# EAGLE design OpenExtruderPCB (EAGLE 9.5.2)
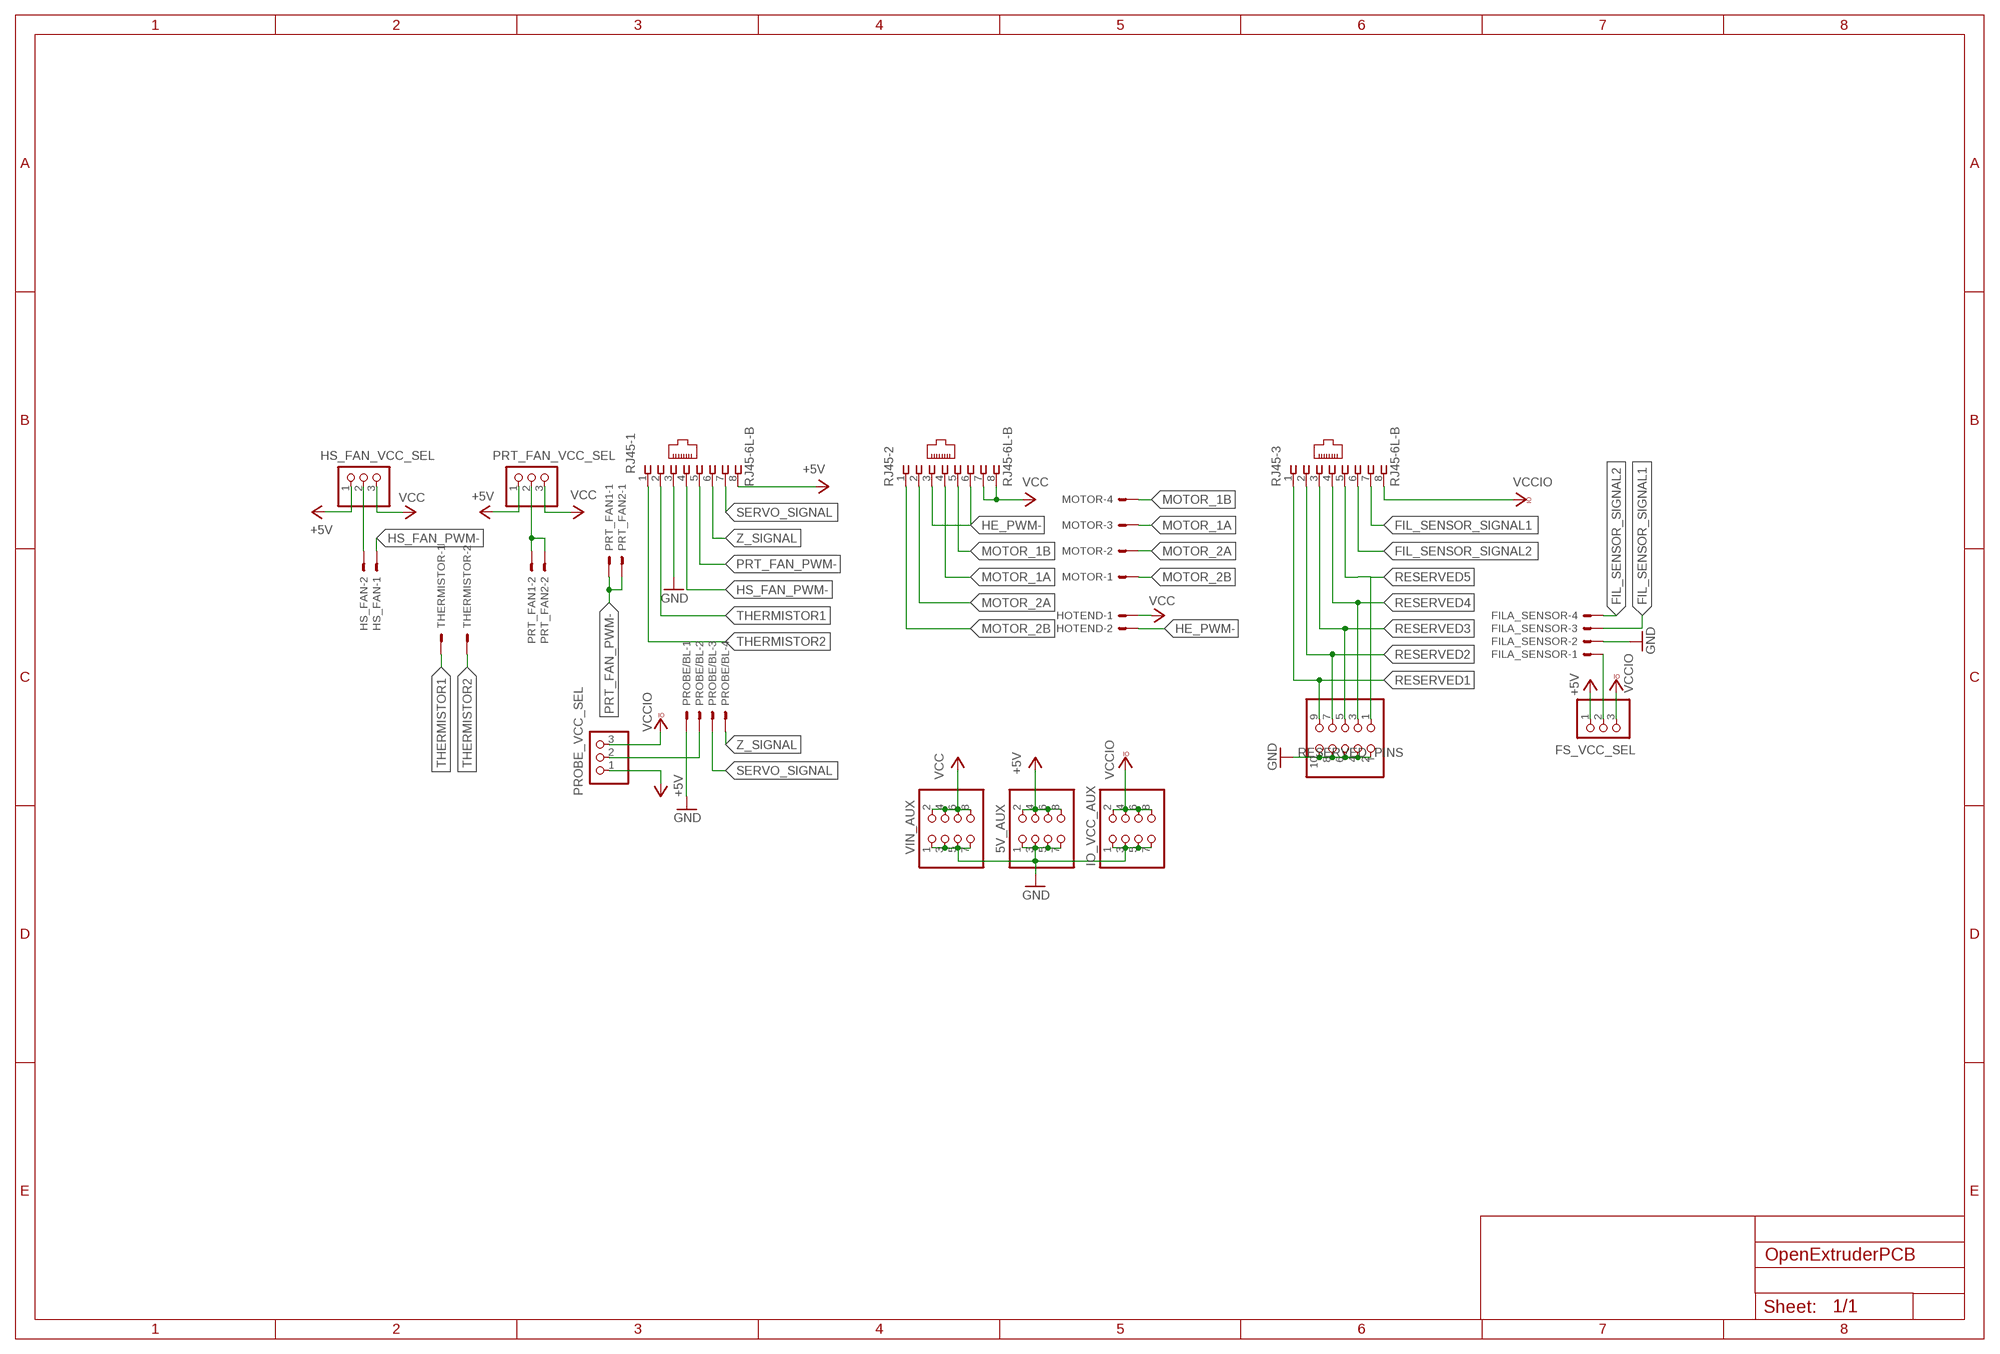
[diagram p0: schematic, sheet 1]

## Parts
5V_AUX  PINHD-2X4M  [2X04M]
FILA_SENSOR  JST-XH-04-PIN-ROUND-PAD  [JST-XH-04-PACKAGE-ROUND-PAD]
FS_VCC_SEL  PINHD-1X3  [1X03]
HOTEND  JST-XH-02-PIN-LONG-PAD  [JST-XH-02-PACKAGE-LONG-PAD]
HS_FAN  JST-XH-02-PIN-ROUND-PAD  [JST-XH-02-PACKAGE-ROUND-PAD]
HS_FAN_VCC_SEL  PINHD-1X3  [1X03]
IO_VCC_AUX  PINHD-2X4M  [2X04M]
MOTOR  JST-XH-04-PIN-LONG-PAD  [JST-XH-04-PACKAGE-LONG-PAD]
PROBE/BL  JST-XH-04-PIN-ROUND-PAD  [JST-XH-04-PACKAGE-ROUND-PAD]
PROBE_VCC_SEL  PINHD-1X3  [1X03]
PRT_FAN1  JST-XH-02-PIN-ROUND-PAD  [JST-XH-02-PACKAGE-ROUND-PAD]
PRT_FAN2  JST-XH-02-PIN-ROUND-PAD  [JST-XH-02-PACKAGE-ROUND-PAD]
PRT_FAN_VCC_SEL  PINHD-1X3  [1X03]
RESERVED_PINS  PINHD-2X5M  [2X05M]
RJ45-1  RJ45-6L-B  [RJ45-NO-SHIELD]
RJ45-2  RJ45-6L-B  [RJ45-NO-SHIELD]
RJ45-3  RJ45-6L-B  [RJ45-NO-SHIELD]
THERMISTOR  JST-XH-02-PIN-ROUND-PAD  [JST-XH-02-PACKAGE-ROUND-PAD]
VIN_AUX  PINHD-2X4M  [2X04M]

## Nets
+5V: 5V_AUX.2 5V_AUX.4 5V_AUX.6 5V_AUX.8 FS_VCC_SEL.1 HS_FAN_VCC_SEL.1 PROBE_VCC_SEL.1 PRT_FAN_VCC_SEL.1 RJ45-1.8
FIL_SENSOR_SIGNAL1: FILA_SENSOR.3 RJ45-3.7
FIL_SENSOR_SIGNAL2: FILA_SENSOR.4 RJ45-3.6
FS_VCC: FILA_SENSOR.1 FS_VCC_SEL.2
GND: 5V_AUX.1 5V_AUX.3 5V_AUX.5 5V_AUX.7 FILA_SENSOR.2 IO_VCC_AUX.1 IO_VCC_AUX.3 IO_VCC_AUX.5 IO_VCC_AUX.7 PROBE/BL.1 RESERVED_PINS.2 RESERVED_PINS.4 RESERVED_PINS.6 RESERVED_PINS.8 RESERVED_PINS.10 RJ45-1.3 VIN_AUX.1 VIN_AUX.3 VIN_AUX.5 VIN_AUX.7
HE_PWM-: HOTEND.2 RJ45-2.3 RJ45-2.6
HS_FAN_PWM-: HS_FAN.1 RJ45-1.4
HS_FAN_VCC: HS_FAN.2 HS_FAN_VCC_SEL.2
MOTOR_1A: MOTOR.3 RJ45-2.4
MOTOR_1B: MOTOR.4 RJ45-2.5
MOTOR_2A: MOTOR.2 RJ45-2.2
MOTOR_2B: MOTOR.1 RJ45-2.1
PROBE_VCC: PROBE/BL.2 PROBE_VCC_SEL.2
PRT_FAN_PWM-: PRT_FAN1.1 PRT_FAN2.1 RJ45-1.5
PRT_FAN_VCC: PRT_FAN1.2 PRT_FAN2.2 PRT_FAN_VCC_SEL.2
RESERVED1: RESERVED_PINS.9 RJ45-3.1
RESERVED2: RESERVED_PINS.7 RJ45-3.2
RESERVED3: RESERVED_PINS.5 RJ45-3.3
RESERVED4: RESERVED_PINS.3 RJ45-3.4
RESERVED5: RESERVED_PINS.1 RJ45-3.5
SERVO_SIGNAL: PROBE/BL.3 RJ45-1.7
THERMISTOR1: RJ45-1.2 THERMISTOR.1
THERMISTOR2: RJ45-1.1 THERMISTOR.2
VCC: HOTEND.1 HS_FAN_VCC_SEL.3 PRT_FAN_VCC_SEL.3 RJ45-2.7 RJ45-2.8 VIN_AUX.2 VIN_AUX.4 VIN_AUX.6 VIN_AUX.8
VCCIO: FS_VCC_SEL.3 IO_VCC_AUX.2 IO_VCC_AUX.4 IO_VCC_AUX.6 IO_VCC_AUX.8 PROBE_VCC_SEL.3 RJ45-3.8
Z_SIGNAL: PROBE/BL.4 RJ45-1.6

## Library data of the parts
5V_AUX IO_VCC_AUX VIN_AUX = pinhead:PINHD-2X4: PIN HEADER
FILA_SENSOR MOTOR PROBE/BL = Rembrandt Electronics - JST XH Connectors v1-0:JST-XH-04-PIN: JST XH Connector 2 Pin Wire to board connector. Pitch: 2,54 mm, (0.100") Number of pins: 4 Created by Rembrandt Electronics www.rembrandtelectronics.com
FS_VCC_SEL HS_FAN_VCC_SEL PROBE_VCC_SEL PRT_FAN_VCC_SEL = pinhead:PINHD-1X3: PIN HEADER
HOTEND HS_FAN PRT_FAN1 PRT_FAN2 THERMISTOR = Rembrandt Electronics - JST XH Connectors v1-0:JST-XH-02-PIN: JST XH Connector 2 Pin Wire to board connector. Pitch: 2,54 mm, (0.100") Number of pins: 2 Created by Rembrandt Electronics www.rembrandtelectronics.com
RESERVED_PINS = pinhead:PINHD-2X5: PIN HEADER
RJ45-1-RJ45-3 = con-tycoelectronics:RJ45: CORCOM Modular RJ Jacks No Shield Source: www.tycoelectronics.com .. ENG_DS_1654001_1099_RJ_L_0507.pdf; MPN: RJ45-6L-B; OC_FARNELL: unknown; OC_NEWARK: 16R6090

## Board
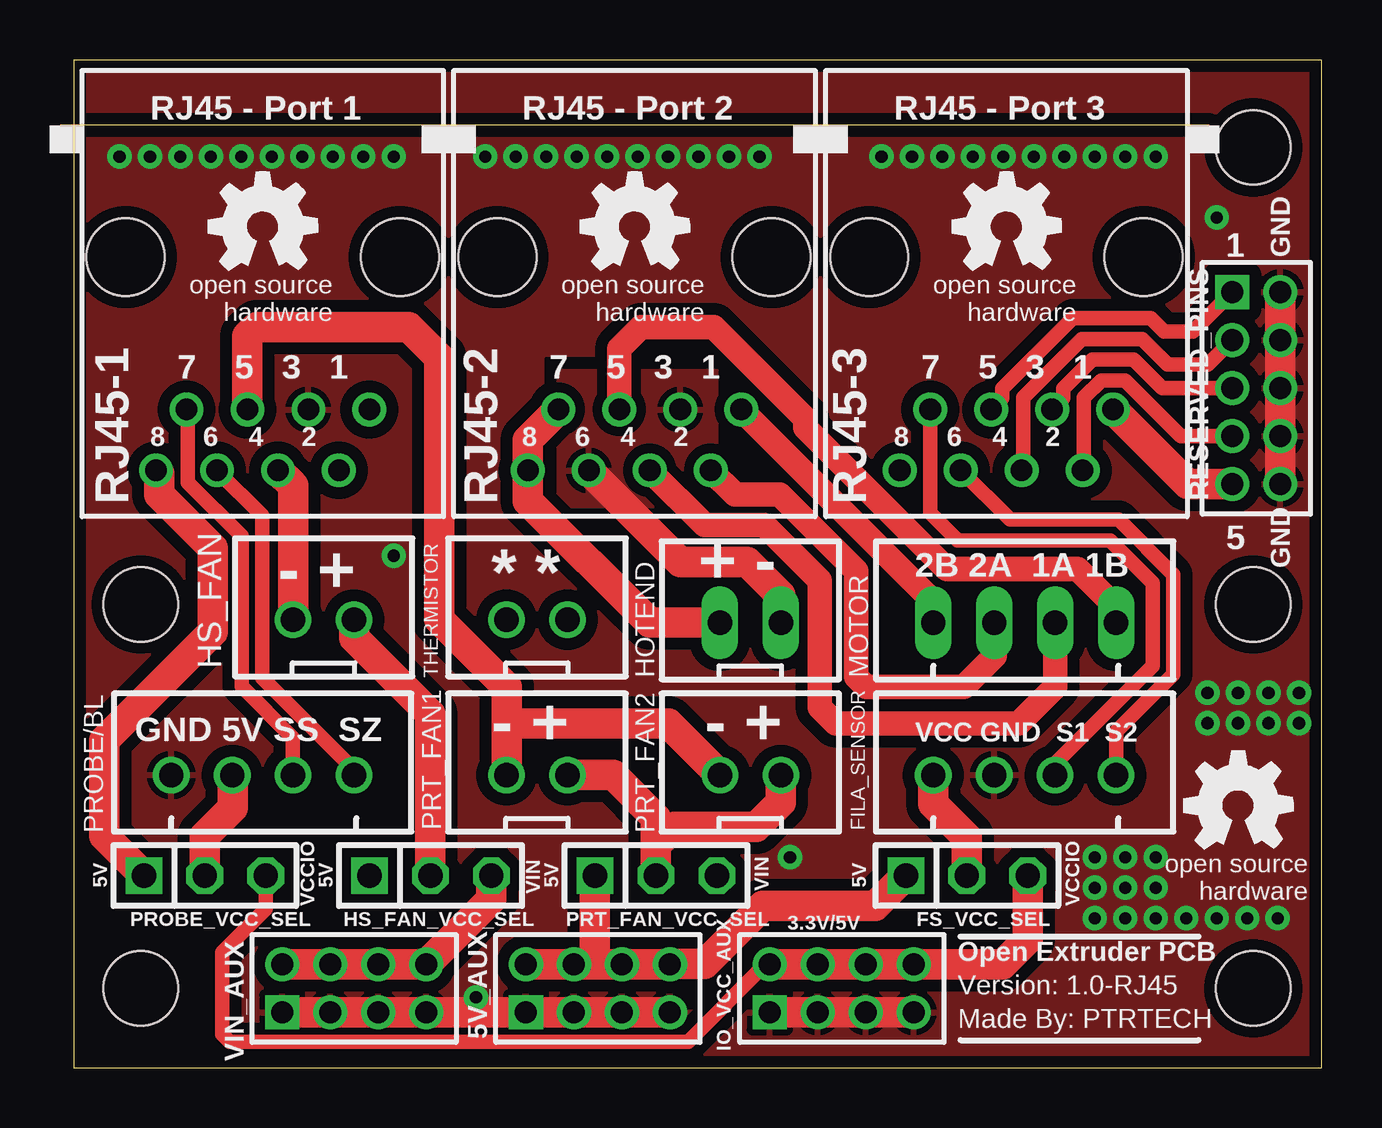
[diagram p1: board, top side]
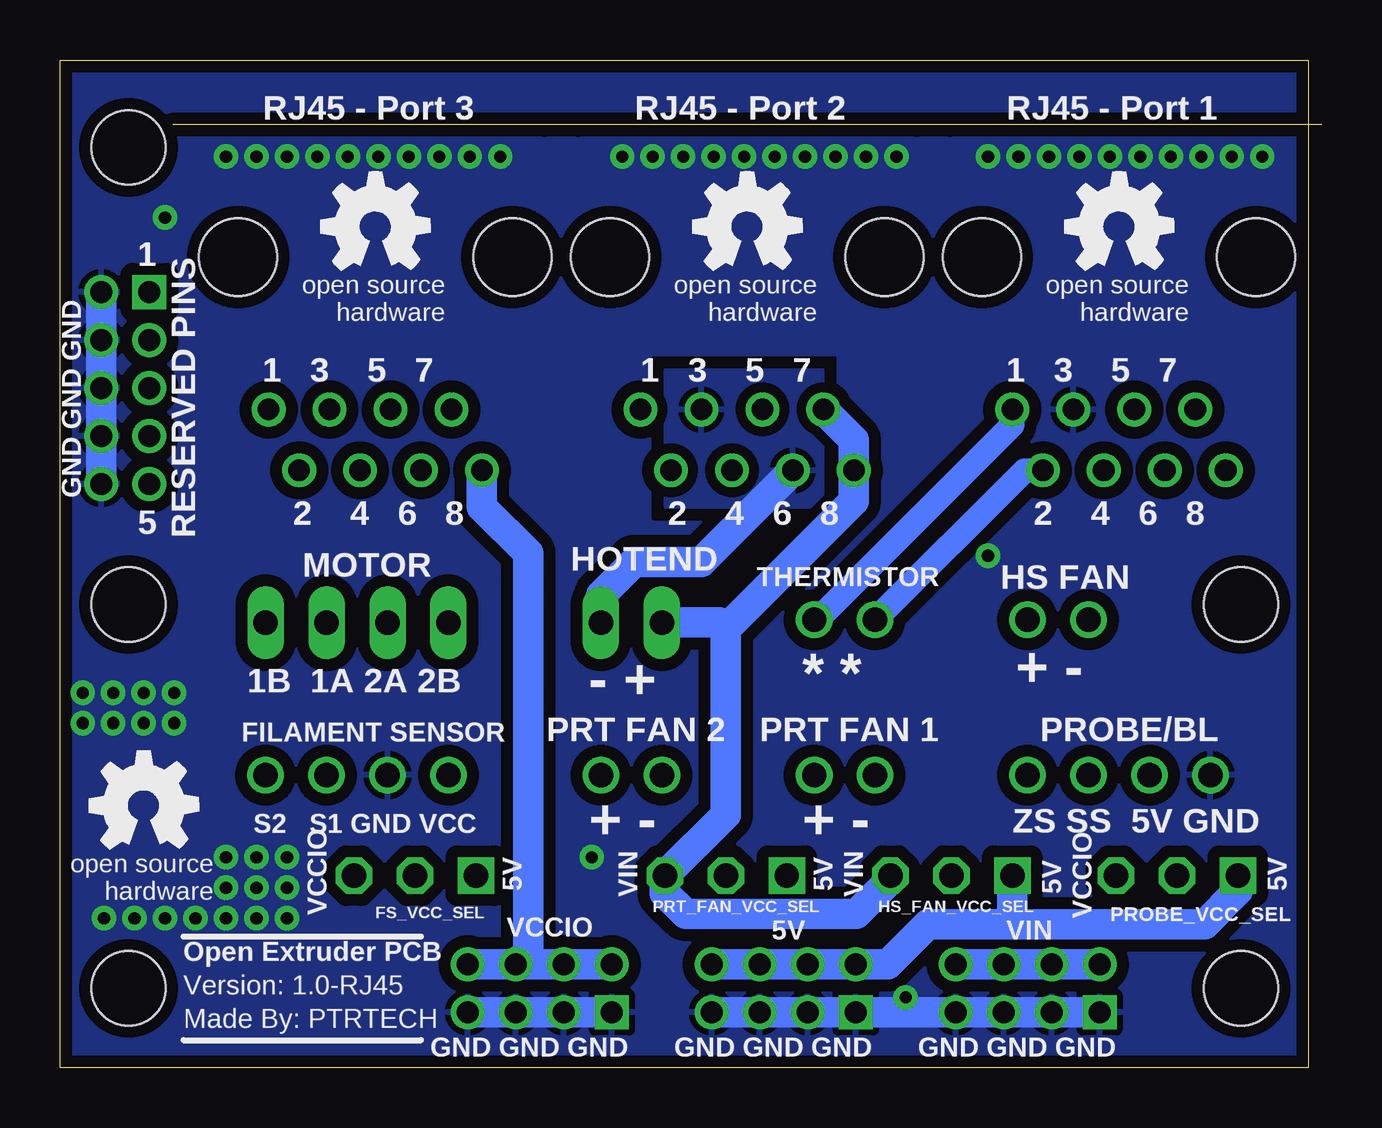
[diagram p2: board, bottom side, seen from below]

Size 52 x 42 mm. Coordinates in mm from the lower left corner, seen from the top.
Outline: 0,0 52,0 52,42 0,42 0,0
Copper layers (1*16): Top 0.035mm / dielectric 1.5mm / Bottom 0.035mm
Design rules "SparkFun-2-layer-STANDARD": minimum track width 10mil, minimum drill 20mil, track to track 10mil, track to pad 8mil, pad to pad 8mil, via to via 10mil, smd to smd 8mil, copper to edge 8mil, drill to drill 8mil, minimum pad ring 10mil, minimum via ring 10mil, stop-mask expansion 4mil, vias tented up to drill 25mil, thermal gap 10mil
Holes 3.1 mm at 2.79,19.3 2.79,3.3 49.15,3.3 49.15,19.3 49.15,38.35

### Footprints (pad centres in the part's own frame; a part is rotated, then mirrored left to right if it is on the bottom)
2X04M = drill 0.914 square: 1 -3,-1 | drill 0.914: 2 -3,1; 3 -1,-1; 4 -1,1; 5 1,-1; 6 1,1; 7 3,-1; 8 3,1
JST-XH-04-PACKAGE-ROUND-PAD = drill 1.016: 1 -3.81,0; 2 -1.27,0; 3 1.27,0; 4 3.81,0
1X03 = drill 1.016 square: 1 -2.54,0 | drill 1.016 octagon: 2 0,0; 3 2.54,0
JST-XH-02-PACKAGE-LONG-PAD = drill 1.016 long: 1 -1.27,0; 2 1.27,0
JST-XH-02-PACKAGE-ROUND-PAD = drill 1.016: 1 -1.27,0; 2 1.27,0
JST-XH-04-PACKAGE-LONG-PAD = drill 1.016 long: 1 -3.81,0; 2 -1.27,0; 3 1.27,0; 4 3.81,0
2X05M = drill 0.914 square: 1 -4,-1 | drill 0.914: 2 -4,1; 3 -2,-1; 4 -2,1; 5 0,-1; 6 0,1; 7 2,-1; 8 2,1; 9 4,-1; 10 4,1
RJ45-NO-SHIELD = drill 0.9 pad 1.4: 1 -4.445,6.35; 2 -3.175,8.89; 3 -1.905,6.35; 4 -0.635,8.89; 5 0.635,6.35; 6 1.905,8.89; 7 3.175,6.35; 8 4.445,8.89 | hole 3.251: -5.715,0; 5.715,0

### Placement (x,y rotation side)
5V_AUX  21.84,3.3 0 top
FILA_SENSOR  39.62,12.19 0 top
FS_VCC_SEL  37.21,8 0 top
HOTEND  28.19,18.54 0 top
HS_FAN  10.41,18.67 0 top
HS_FAN_VCC_SEL  14.86,8 0 top
IO_VCC_AUX  32,3.3 0 top
MOTOR  39.62,18.54 0 top
PROBE/BL  7.87,12.19 0 top
PROBE_VCC_SEL  5.46,8 0 top
PRT_FAN1  19.3,12.19 0 top
PRT_FAN2  28.19,12.19 0 top
PRT_FAN_VCC_SEL  24.26,8 0 top
RESERVED_PINS  49.28,28.32 270 top
RJ45-1  7.87,33.78 180 top
RJ45-2  23.37,33.78 180 top
RJ45-3  38.86,33.78 180 top
THERMISTOR  19.3,18.67 0 top
U$1  [OSHW_5MM]  23.37,35.05 0 top
U$2  [OSHW_5MM]  38.86,35.05 0 top
U$3  [OSHW_5MM]  7.87,35.05 0 top
U$4  [OSHW_5MM]  7.87,35.05 0 bottom
U$5  [OSHW_5MM]  23.37,35.05 0 bottom
U$6  [OSHW_5MM]  38.86,35.05 0 bottom
U$7  [OSHW_5MM]  48.51,10.92 0 top
U$8  [OSHW_5MM]  48.51,10.92 0 bottom
VIN_AUX  11.68,3.3 0 top

### Tracks (layer width: path | path; a pad name or v marks a point on that pad's centre or on a via)
+5V
  Top 1.27: 5V_AUX.2 5V_AUX.4 21.59,4.3 | 21.59,4.3 5V_AUX.6 5V_AUX.8 24.86,4.32 26.29,4.32 28.7,6.73 33.4,6.73 FS_VCC_SEL.1 | PROBE_VCC_SEL.1 1.27,9.65 1.27,13.63 5.8,18.16 5.8,21.66 3.56,23.89 3.56,24.76 RJ45-1.8 | PRT_FAN_VCC_SEL.1 21.72,4.43 21.59,4.3
  Bottom 1.27: 5V_AUX.8 5V_AUX.6 5V_AUX.4 5V_AUX.2 17.51,4.3 15.83,5.98 12.7,5.98 | PROBE_VCC_SEL.1 2.92,7.37 4.31,5.98 12.7,5.98 | HS_FAN_VCC_SEL.1 12.32,6.36 12.7,5.98
FIL_SENSOR_SIGNAL1
  Top 0.61: RJ45-3.7 35.69,23.11 36.83,21.97 43.18,21.97 44.96,20.19 44.96,16.75 40.89,12.68 FILA_SENSOR.3
FIL_SENSOR_SIGNAL2
  Top 0.61: RJ45-3.6 39.01,22.84 43.54,22.84 45.82,20.55 45.82,16.39 43.43,14 FILA_SENSOR.4
FS_VCC
  Top 1.27: FS_VCC_SEL.2 37.21,9.59 35.81,10.98 FILA_SENSOR.1
GND  (via drill 0.51)
  Top 1.27: RESERVED_PINS.10 RESERVED_PINS.8 RESERVED_PINS.6 RESERVED_PINS.4 RESERVED_PINS.2 | VIN_AUX.1 VIN_AUX.3 VIN_AUX.5 VIN_AUX.7 5V_AUX.1 5V_AUX.3 5V_AUX.5 5V_AUX.7 | IO_VCC_AUX.1 IO_VCC_AUX.3 IO_VCC_AUX.5 IO_VCC_AUX.7
  Bottom 1.27: RESERVED_PINS.2 RESERVED_PINS.4 RESERVED_PINS.6 RESERVED_PINS.8 RESERVED_PINS.10 | IO_VCC_AUX.7 IO_VCC_AUX.5 IO_VCC_AUX.3 IO_VCC_AUX.1 | 5V_AUX.7 5V_AUX.5 5V_AUX.3 5V_AUX.1 VIN_AUX.7 VIN_AUX.5 VIN_AUX.3 VIN_AUX.1
  other vias: 16.76,2.92 47.24,15.62 48.51,15.62 49.78,15.62 49.78,14.35 48.51,14.35 47.24,14.35 51.05,14.35 51.05,15.62 42.55,6.22 43.81,6.22 45.09,6.22 46.35,6.22 43.81,7.49 42.55,7.49 45.09,7.49 43.81,8.76 42.55,8.76 29.84,8.76 1.91,37.97 3.17,37.97 4.45,37.97 5.71,37.97 6.99,37.97 8.26,37.97 10.79,37.97 9.53,37.97 12.06,37.97 13.34,37.97 45.09,8.76 17.14,37.97 18.41,37.97 19.68,37.97 20.95,37.97 22.23,37.97 23.5,37.97 26.04,37.97 24.77,37.97 27.3,37.97 28.57,37.97 33.66,37.97 34.92,37.97 36.2,37.97 37.47,37.97 38.73,37.97 40.01,37.97 42.55,37.97 41.27,37.97 43.81,37.97 45.09,37.97 47.62,35.43 47.62,6.22 48.9,6.22 50.16,6.22 13.34,21.34
  pour Top (isolate 0.5, rank 6): -1.27,43.18 54.61,43.18 54.61,-1.27 -1.27,-1.27
  pour Bottom (isolate 0.5, rank 6): -2.54,44.45 55.88,44.45 55.88,-3.81 -2.54,-3.81
HE_PWM-
  Top 1.27: RJ45-2.6 25.27,21.08 28.07,21.08 29.44,19.7 29.44,18.56 HOTEND.2
  Bottom 1.27: RJ45-2.6 25.27,21.08 28.07,21.08 29.44,19.7 29.44,18.56 HOTEND.2
  pour Top (isolate 0.406): 20.19,29.08 26.8,29.08 26.8,23.37 20.19,23.37
  pour Bottom (isolate 0.406): 20.19,29.08 26.8,29.08 26.8,23.37 20.19,23.37
HS_FAN_PWM-
  Top 1.27: RJ45-1.4 9.14,24.26 HS_FAN.1
HS_FAN_VCC
  Top 1.27: HS_FAN_VCC_SEL.2 14.86,14.73 11.68,17.91 HS_FAN.2
MOTOR_1A
  Top 1.016: RJ45-2.4 26.29,22.61 28.77,22.61 31.08,20.3 31.08,15.02 31.75,14.35 39.37,14.35 40.89,15.88 MOTOR.3
MOTOR_1B
  Top 1.016: RJ45-2.5 22.73,29.97 23.62,30.86 26.67,30.86 30.48,27.05 30.48,26.67 36.37,20.78 41.83,20.78 43.43,19.18 MOTOR.4
MOTOR_2A
  Top 1.016: RJ45-2.2 27.56,23.88 29.43,23.88 32.61,20.7 32.61,16.29 33.02,15.88 37.08,15.88 38.37,17.16 38.35,17.18 MOTOR.2
MOTOR_2B
  Top 1.016: MOTOR.1 35.81,19.43 RJ45-2.1
PROBE_VCC
  Top 1.27: PROBE_VCC_SEL.2 5.46,9.65 6.62,10.81 6.62,12.17 PROBE/BL.2
PRT_FAN_PWM-
  Top 1.27: RJ45-1.5 7.24,30.48 7.62,30.86 13.97,30.86 15.24,29.59 15.24,18.67 18.03,15.88 18.03,14.35 | 18.03,14.35 PRT_FAN1.1 | PRT_FAN2.1 24.77,14.35 18.03,14.35
PRT_FAN_VCC
  Top 1.27: PRT_FAN_VCC_SEL.2 24.26,9.27 | 24.26,9.27 24.26,10.41 22.48,12.19 PRT_FAN1.2 | 24.26,9.27 25.02,10.03 28.45,10.03 29.46,11.05 PRT_FAN2.2
RESERVED1
  Top 1.27: RESERVED_PINS.9 46.42,24.32 RJ45-3.1
RESERVED2
  Top 0.61: RJ45-3.2 42.09,24.95 42.09,27.93 42.8,28.64 43.81,28.64 46.13,26.32 RESERVED_PINS.7
RESERVED3
  Top 0.61: RJ45-3.3 41.23,27.9 41.23,28.29 42.45,29.51 44.17,29.51 45.35,28.32 RESERVED_PINS.5
RESERVED4
  Top 0.61: RJ45-3.4 39.55,24.95 39.55,27.93 41.99,30.37 44.52,30.37 45.59,29.3 47.26,29.3 RESERVED_PINS.3
RESERVED5
  Top 0.61: RJ45-3.5 38.69,27.9 38.69,28.29 41.63,31.23 44.88,31.23 45.44,30.68 46.63,30.68 RESERVED_PINS.1
SERVO_SIGNAL
  Top 0.61: RJ45-1.7 4.76,27.37 4.76,24.39 6.99,22.16 6.99,15.88 9.12,13.75 9.12,12.21 PROBE/BL.3
THERMISTOR1
  Bottom 1.016: THERMISTOR.1 11.81,24.89 RJ45-1.2
THERMISTOR2
  Bottom 1.016: RJ45-1.1 12.32,26.78 20.43,18.67 THERMISTOR.2
VCC
  Top 1.27: VIN_AUX.2 VIN_AUX.4 VIN_AUX.6 VIN_AUX.8 17.4,7.02 HS_FAN_VCC_SEL.3 | RJ45-2.7 18.92,26.16 RJ45-2.8 18.92,23.62 24,18.54 HOTEND.1
  Bottom 1.27: VIN_AUX.2 VIN_AUX.4 VIN_AUX.6 VIN_AUX.8 | RJ45-2.7 18.92,26.16 RJ45-2.8 18.92,23.62 24.26,18.29 | 24.26,18.29 24.51,18.54 HOTEND.1 | 24.26,18.29 24.26,10.54 PRT_FAN_VCC_SEL.3 26.8,7.26 25.94,6.4 18.83,6.4 17.4,7.83 HS_FAN_VCC_SEL.3
VCCIO
  Top 0.61: IO_VCC_AUX.2 28.82,4.3 25.6,1.08 6.49,1.08 6.2,1.38 6.2,4.81 8,6.61 PROBE_VCC_SEL.3
  Top 1.27: IO_VCC_AUX.2 IO_VCC_AUX.4 IO_VCC_AUX.6 IO_VCC_AUX.8 38.72,4.3 39.75,5.33 FS_VCC_SEL.3
  Bottom 1.27: IO_VCC_AUX.2 IO_VCC_AUX.4 IO_VCC_AUX.6 | IO_VCC_AUX.6 IO_VCC_AUX.8 | RJ45-3.8 34.42,23.37 32.5,21.45 32.5,4.81 IO_VCC_AUX.6
Z_SIGNAL
  Top 0.61: RJ45-1.6 7.86,23 7.86,16.24 11.62,12.47 11.62,12.25 PROBE/BL.4

### Text on the board
tPlace: RJ45 - Port 1 | RJ45 - Port 2 | RJ45 - Port 3 | 1 | GND | 7 5 3 1 | 7 5 3 1 | 7 5 3 1 | 8 6 4 2 | 8 6 4 2 | 8 6 4 2 | 5 | GND | - + | * * | + - | 2B 2A 1A 1B | GND 5V SS SZ | VCC GND S1 S2 | - + | - + | 5V | VCCIO | 5V | VIN | 5V | VIN | 5V | VCCIO | 3.3V/5V
bPlace: RJ45 - Port 1 | RJ45 - Port 2 | RJ45 - Port 3 | RESERVED PINS | 1 | GND GND GND | 1 3 5 7 | 1 3 5 7 | 1 3 5 7 | 2 4 6 8 | 2 4 6 8 | 2 4 6 8 | 5 | HOTEND | HS FAN | THERMISTOR | MOTOR | + - | * * | 1B 1A 2A 2B | - + | PROBE/BL | PRT FAN 1 | PRT FAN 2 | FILAMENT SENSOR | ZS SS 5V GND | + - | + - | S2 S1 GND VCC | 5V | 5V | VIN | 5V | VIN | 5V | PROBE_VCC_SEL | VCCIO | HS_FAN_VCC_SEL | PRT_FAN_VCC_SEL | FS_VCC_SEL | VCCIO | VIN | 5V | VCCIO | GND GND GND | GND GND GND | GND GND GND